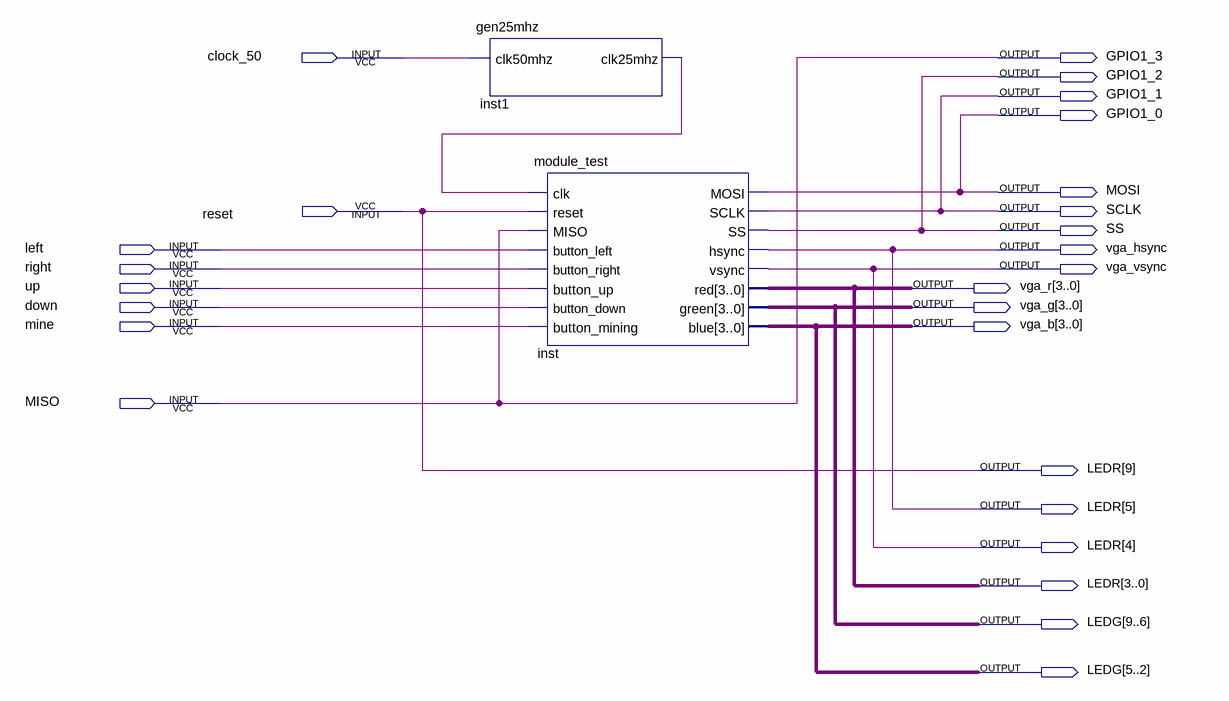
[diagram p0: schematic sheet]
// Quartus schematic top_de1.bdf as structural Verilog: 2 symbols, 26 pins
module top_de1 (
  input  clock_50,
  input  reset,
  input  left,
  input  right,
  input  up,
  input  down,
  input  mine,
  input  MISO,
  output GPIO1_3,
  output GPIO1_2,
  output GPIO1_1,
  output GPIO1_0,
  output MOSI,
  output SCLK,
  output SS,
  output vga_hsync,
  output vga_vsync,
  output [3:0] vga_r,
  output [3:0] vga_g,
  output [3:0] vga_b,
  output [9:0] LEDR,
  output [9:2] LEDG
);

  wire inst1_clk25mhz;

  gen25mhz inst1 (.clk50mhz(clock_50), .clk25mhz(inst1_clk25mhz));
  module_test inst (
    .clk(inst1_clk25mhz), .reset(reset), .MISO(MISO), .button_left(left), .button_right(right),
    .button_up(up), .button_down(down), .button_mining(mine), .MOSI(GPIO1_0), .SCLK(GPIO1_1), .SS(GPIO1_2),
    .hsync(LEDR[5]), .vsync(LEDR[4]), .red(LEDR[3:0]), .green(LEDG[9:6]), .blue(LEDG[5:2]));

  assign GPIO1_3 = MISO;
  assign LEDR[9] = reset;
  assign MOSI = GPIO1_0;
  assign SCLK = GPIO1_1;
  assign SS = GPIO1_2;
  assign vga_b = LEDG[5:2];
  assign vga_g = LEDG[9:6];
  assign vga_hsync = LEDR[5];
  assign vga_r = LEDR[3:0];
  assign vga_vsync = LEDR[4];
endmodule
